# EAGLE design WOH (EAGLE 5.11)
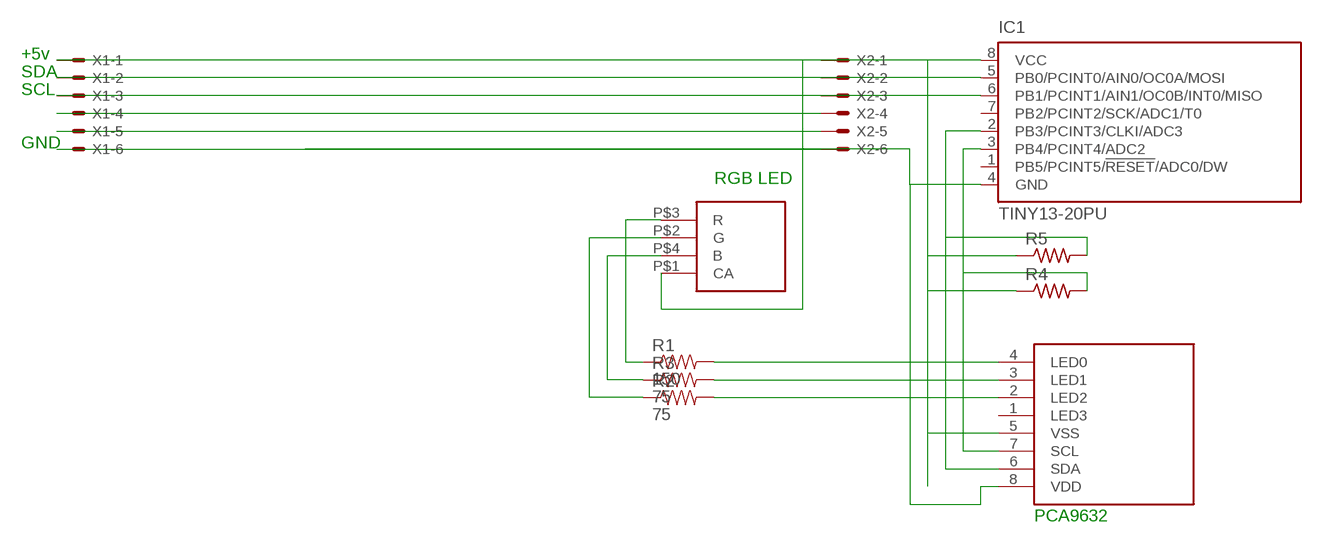
[diagram p0: schematic, sheet 1]

## Parts
IC1  TINY13-20PU  [DIL08]
R1  150  RESISTORPTH-1/4W  [AXIAL-0.4]
R2  75  RESISTORPTH-1/4W  [AXIAL-0.4]
R3  75  RESISTORPTH-1/4W  [AXIAL-0.4]
R4  R-US_0207/7  [0207/7]
R5  R-US_0207/7  [0207/7]
U$1  RGBLED  [RGBLED]
U$2  PCA9632  [TSSOP-8]
X1  22-23-2061  [22-23-2061]
X2  22-23-2061  [22-23-2061]

## Nets
GND: IC1.4(GND) U$2.8(VDD) X1.6 X2.6
N$1: IC1.2(PB3/PCINT3/CLKI/ADC3) R5.2 U$2.6(SDA)
N$2: IC1.3(PB4/PCINT4/ADC2) R4.2 U$2.7(SCL)
N$3: R1.P$1 U$1.P$3(R)
N$5: IC1.8(VCC) R4.1 R5.1 U$1.P$1(CA) U$2.5(VSS) X1.1 X2.1
N$6: X1.4 X2.4
N$7: X1.5 X2.5
N$8: R1.P$2 U$2.4(LED0)
N$9: R2.P$2 U$2.2(LED2)
N$10: IC1.5(PB0/PCINT0/AIN0/OC0A/MOSI) X1.2 X2.2
N$11: IC1.6(PB1/PCINT1/AIN1/OC0B/INT0/MISO) X1.3 X2.3
N$12: R3.P$2 U$2.3(LED1)
N$13: R2.P$1 U$1.P$2(G)
N$14: R3.P$1 U$1.P$4(B)
Unconnected: IC1.1(PB5/PCINT5/!RESET!/ADC0/DW) IC1.7(PB2/PCINT2/SCK/ADC1/T0) U$2.1(LED3)

## Notes on the sheet
- +5v
- SDA
- SCL
- GND
- RGB LED
- PCA9632

## Library data of the parts
IC1 = atmel:TINY13: 8-bit AVR Microcontroller with 1K Bytes In-System Programmable Flash Source: http://www.atmel.com/dyn/resources/prod_documents/2535S.pdf; MPN: ATTINY13-20PU; OC_FARNELL: 9171550; OC_NEWARK: 96K6521
R1-R3 = SparkFun:RESISTOR: Resistor Basic schematic elements and footprints for 0603, 1206, and PTH resistors.
R4 R5 = resistor:R-US_: RESISTOR, American symbol
U$1 = rtavk3:RGBLED
U$2 = rtavk3:PCA9632: PCA9632 4 bit I2C Led Driver Source: http://www.nxp.com/documents/data_sheet/PCA9632.pdf
X1 X2 = con-molex:22-23-2061: .100" (2.54mm) Center Header - 6 Pin; MF: MOLEX; MPN: 22-23-2061; OC_FARNELL: 1462922; OC_NEWARK: 27C1933

## Board
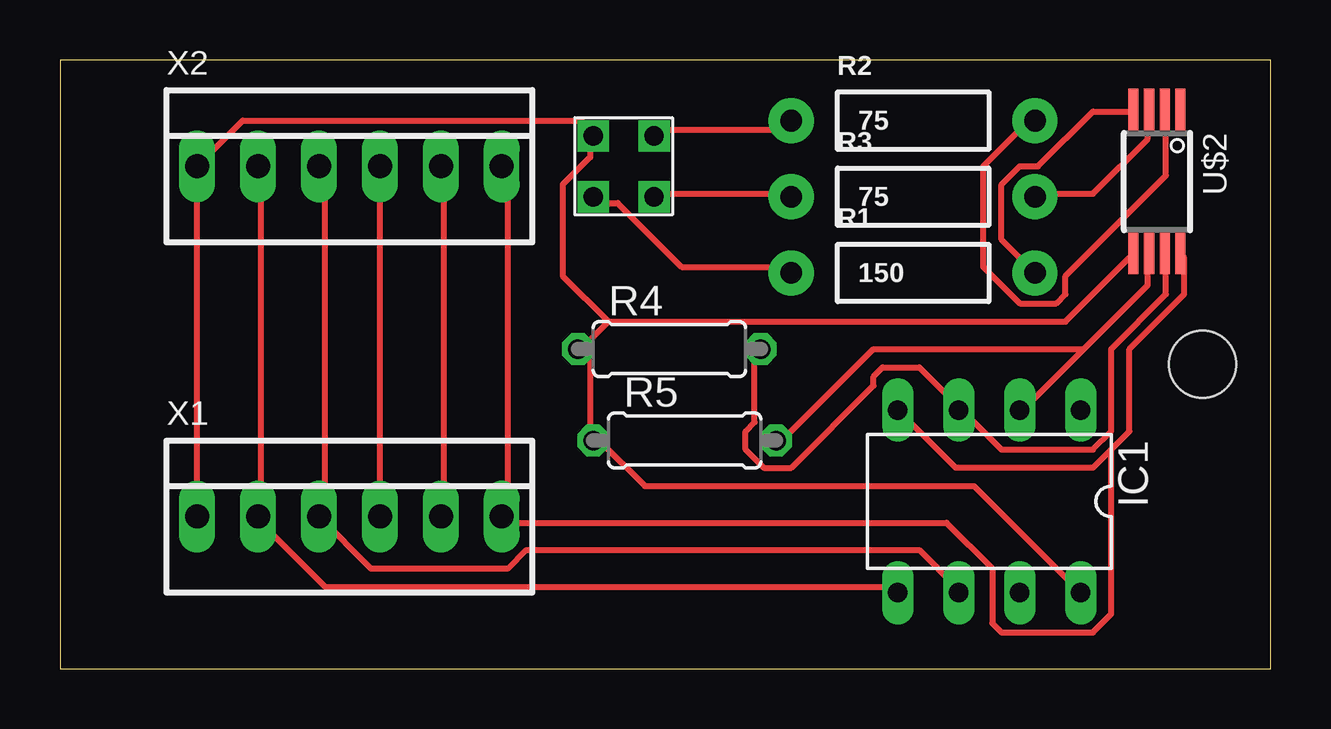
[diagram p1: board, top side]

Size 50.47 x 25.39 mm. Coordinates in mm from the lower left corner, seen from the top.
Outline: 0,0 50.47,0 50.47,25.39 0,25.39 0,0
Copper layers (1*16): Top 0.035mm / dielectric 1.5mm / Bottom 0.035mm
Design rules "default": minimum track width 10mil, minimum drill 24mil, track to track 8mil, track to pad 8mil, pad to pad 8mil, via to via 8mil, smd to smd 8mil, copper to edge 40mil, drill to drill 8mil, minimum pad ring 10mil, minimum via ring 8mil, stop-mask expansion 4mil, vias tented up to drill 0mil, thermal gap 10mil
Holes 2.8 mm at 47.62,12.7

### Footprints (pad centres in the part's own frame; a part is rotated, then mirrored left to right if it is on the bottom)
DIL08 = drill 0.813 long: 1 -3.81,-3.81; 2 -1.27,-3.81; 3 1.27,-3.81; 4 3.81,-3.81; 5 3.81,3.81; 6 1.27,3.81; 7 -1.27,3.81; 8 -3.81,3.81
AXIAL-0.4 = drill 0.9 pad 1.88 round: P$1 -5.08,0; P$2 5.08,0
0207/7 = drill 0.813 octagon: 1 -3.81,0; 2 3.81,0
RGBLED = drill 0.8 square: P$1 -1.27,1.27; P$2 1.27,1.27; P$3 -1.27,-1.27; P$4 1.27,-1.27
TSSOP-8 = smd 0.42 x 1.78: 1 -0.975,-2.975; 2 -0.325,-2.975; 3 0.325,-2.975; 4 0.975,-2.975; 5 0.975,2.975; 6 0.325,2.975; 7 -0.325,2.975; 8 -0.975,2.975
22-23-2061 = drill 1 long: 1 -6.35,0; 2 -3.81,0; 3 -1.27,0; 4 1.27,0; 5 3.81,0; 6 6.35,0

### Placement (x,y rotation side)
IC1  38.73,6.99 180 top
R1  35.56,16.51 0 top
R2  35.56,22.86 0 top
R3  35.56,19.68 0 top
R4  25.4,13.34 0 top
R5  26.04,9.53 0 top
U$1  23.5,20.95 0 top
U$2  45.72,20.32 180 top
X1  12.06,6.35 0 top
X2  12.06,20.95 0 top

### Tracks (layer width: path | path; a pad name or v marks a point on that pad's centre or on a via)
GND
  Top 0.254: X2.6 18.67,20.95 18.67,6.48 X1.6 18.67,6.1 36.96,6.1 38.86,4.19 38.86,1.91 39.24,1.52 43.05,1.52 43.81,2.29 43.81,9.14 | 43.81,9.14 43.05,8.38 37.34,8.38 IC1.4 | 43.81,9.14 44.58,9.91 44.58,13.34 46.86,15.62 46.86,17.14 U$2.8
N$1
  Top 0.254: 42.67,13.34 40.01,10.67 IC1.2 | 42.67,13.34 45.34,16 45.34,17.14 U$2.6 | 42.67,13.34 33.91,13.34 30.1,9.53 R5.2
N$2
  Top 0.254: U$2.7 46.1,17.14 46.1,15.62 43.81,13.34 43.81,9.91 43.05,9.14 39.24,9.14 37.72,10.67 IC1.3 37.34,11.05 35.81,12.57 34.29,12.57 33.91,12.19 33.91,11.81 30.48,8.38 29.34,8.38 28.57,9.14 28.57,9.91 28.96,10.29 28.96,13.34 R4.2
N$3
  Top 0.254: U$1.P$3 22.48,19.43 23.24,19.43 25.91,16.76 30.48,16.76 R1.P$1
N$5
  Top 0.254: X1.1 X2.1 7.62,22.86 21.72,22.86 22.1,22.48 U$1.P$1 22.1,22.1 22.1,21.34 20.95,20.19 20.95,16.38 22.86,14.48 | 22.86,14.48 41.91,14.48 44.58,17.14 U$2.5 | 22.1,13.72 21.72,13.34 R4.1 22.1,13.72 | 22.86,14.48 22.1,13.72 | 22.1,13.72 22.1,9.53 R5.1 22.48,9.53 24.38,7.62 38.1,7.62 IC1.8
N$6
  Top 0.254: X1.4 X2.4
N$7
  Top 0.254: X1.5 16,6.48 16,20.95 X2.5
N$8
  Top 0.254: U$2.4 44.58,23.24 43.05,23.24 40.77,20.95 40.01,20.95 39.24,20.19 39.24,17.91 R1.P$2
N$9
  Top 0.254: U$2.2 46.1,23.24 46.1,20.57 41.91,16.38 41.91,15.62 41.53,15.24 40.01,15.24 38.48,16.76 38.48,20.95 40.39,22.86 R2.P$2
N$10
  Top 0.254: IC1.5 34.67,3.43 11.05,3.43 8.38,6.1 X1.2 8.38,6.48 8.38,20.95 X2.2
N$11
  Top 0.254: IC1.6 37.34,3.43 35.81,4.95 19.43,4.95 18.67,4.19 12.95,4.19 X1.3 11.05,6.48 11.05,20.95 X2.3
N$12
  Top 0.254: U$2.3 45.34,23.24 45.34,22.1 43.05,19.81 40.77,19.81 R3.P$2
N$13
  Top 0.254: R2.P$1 30.1,22.48 24.77,22.48 U$1.P$2
N$14
  Top 0.254: U$1.P$4 24.77,19.81 30.48,19.81 R3.P$1